# Altium project KX1_DB.PrjPcb (part 1 of 2)
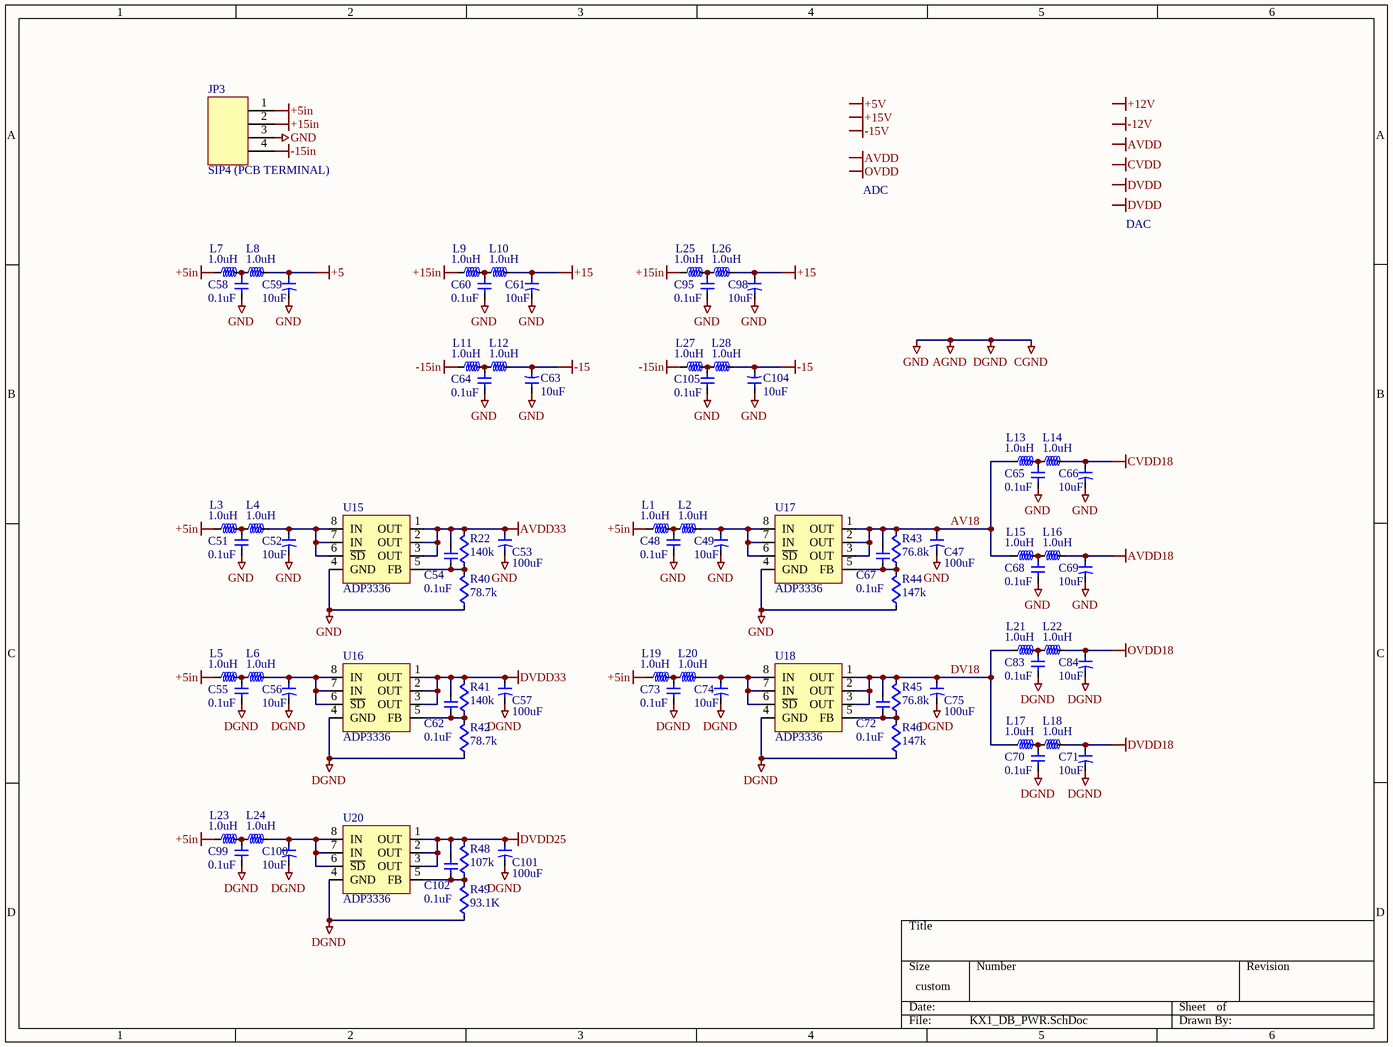
[diagram p0: KX1_DB_PWR.SchDoc]
4 sheets, 201 parts. Net scope: global (net labels, ports and power ports of the same name join across sheets).
Board file: KX1_DB.PcbDoc
Sheets:
  KX1_DB_PWR.SchDoc
  KX1_DB_ADC_2.SchDoc
  KX1_DB_DAC_1.SchDoc
  KX1_DB_EX_CONN.SchDoc

## Sheet KX1_DB_PWR.SchDoc
size 260 x 195 mm

### Parts
C47  100uF  [1206]
C48  0.1uF  [0603w]
C49  10uF  [1206]
C51  0.1uF  [0603w]
C52  10uF  [1206]
C53  100uF  [1206]
C54  0.1uF  [0603w]
C55  0.1uF  [0603w]
C56  10uF  [1206]
C57  100uF  [1206]
C58  0.1uF  [0603w]
C59  10uF  [1206]
C60  0.1uF  [0603w]
C61  10uF  [1206]
C62  0.1uF  [0603w]
C63  10uF  [1206]
C64  0.1uF  [0603w]
C65  0.1uF  [0603w]
C66  10uF  [1206]
C67  0.1uF  [0603w]
C68  0.1uF  [0603w]
C69  10uF  [1206]
C70  0.1uF  [0603w]
C71  10uF  [1206]
C72  0.1uF  [0603w]
C73  0.1uF  [0603w]
C74  10uF  [1206]
C75  100uF  [1206]
C83  0.1uF  [0603w]
C84  10uF  [1206]
C95  0.1uF  [0603w]
C98  10uF  [1206]
C99  0.1uF  [0603w]
C100  10uF  [1206]
C101  100uF  [1206]
C102  0.1uF  [0603w]
C104  10uF  [1206]
C105  0.1uF  [0603w]
JP3  SIP4 (PCB TERMINAL)  [SIP4MOLEX]
L1  1.0uH  [1210]
L2  1.0uH  [1210]
L3  1.0uH  [0805]
L4  1.0uH  [0805]
L5  1.0uH  [0805]
L6  1.0uH  [0805]
L7  1.0uH  [1210]
L8  1.0uH  [1210]
L9  1.0uH  [1210]
L10  1.0uH  [1210]
L11  1.0uH  [1210]
L12  1.0uH  [1210]
L13  1.0uH  [0805]
L14  1.0uH  [0805]
L15  1.0uH  [1210]
L16  1.0uH  [1210]
L17  1.0uH  [0805]
L18  1.0uH  [0805]
L19  1.0uH  [0805]
L20  1.0uH  [0805]
L21  1.0uH  [0805]
L22  1.0uH  [0805]
L23  1.0uH  [0805]
L24  1.0uH  [0805]
L25  1.0uH  [1210]
L26  1.0uH  [1210]
L27  1.0uH  [1210]
L28  1.0uH  [1210]
R22  140k  [0603w]
R40  78.7k  [0603w]
R41  140k  [0603w]
R42  78.7k  [0603w]
R43  76.8k  [0603w]
R44  147k  [0603w]
R45  76.8k  [0603w]
R46  147k  [0603w]
R48  107k  [0603w]
R49  93.1K  [0603w]
U15  ADP3336  [MSOP08]
U16  ADP3336  [MSOP08]
U17  ADP3336  [MSOP08]
U18  ADP3336  [MSOP08]
U20  ADP3336  [MSOP08]

### Nets
+5: C59.1 L8.2
+5in: JP3.1 L1.1 L3.1 L5.1 L7.1 L19.1 L23.1
+15: C61.1 C98.1 L10.2 L26.2
+15in: JP3.2 L9.1 L25.1
-15: C63.2 C104.2 L12.2 L28.2
-15in: JP3.4 L11.1 L27.1
AGND: C47.2 C48.2 C49.2 C51.2 C52.2 C53.2 C55.2 C56.2 C57.2 C58.2 C59.2 C60.2 C61.2 C63.1 C64.2 C65.2 C66.2 C68.2 C69.2 C70.2 C71.2 C73.2 C74.2 C75.2 C83.2 C84.2 C95.2 C98.2 C99.2 C100.2 C101.2 C104.1 C105.2 JP3.3 R40.1 R42.1 R44.1 R46.1 R49.1 U15.4(GND) U16.4(GND) U17.4(GND) U18.4(GND) U20.4(GND)  [also labelled CGND, DGND, GND]
AVDD18: C69.1 L16.2
AVDD33: C53.1 C54.1 R22.2 U15.1(OUT) U15.2(OUT) U15.3(OUT)
CVDD18: C66.1 L14.2
DVDD18: C71.1 L18.2
DVDD25: C101.1 C102.1 R48.2 U20.1(OUT) U20.2(OUT) U20.3(OUT)
DVDD33: C57.1 C62.1 R41.2 U16.1(OUT) U16.2(OUT) U16.3(OUT)
OVDD18: C84.1 L22.2
AV18: C47.1 C67.1 L13.1 L15.1 R43.2 U17.1(OUT) U17.2(OUT) U17.3(OUT)
DV18: C72.1 C75.1 L17.1 L21.1 R45.2 U18.1(OUT) U18.2(OUT) U18.3(OUT)
NetC48_1: C48.1 L1.2 L2.1
NetC49_1: C49.1 L2.2 U17.6(~{SD}) U17.7(IN) U17.8(IN)
NetC51_1: C51.1 L3.2 L4.1
NetC52_1: C52.1 L4.2 U15.6(~{SD}) U15.7(IN) U15.8(IN)
NetC54_2: C54.2 R22.1 R40.2 U15.5(FB)
NetC55_1: C55.1 L5.2 L6.1
NetC56_1: C56.1 L6.2 U16.6(~{SD}) U16.7(IN) U16.8(IN)
NetC58_1: C58.1 L7.2 L8.1
NetC60_1: C60.1 L9.2 L10.1
NetC62_2: C62.2 R41.1 R42.2 U16.5(FB)
NetC64_1: C64.1 L11.2 L12.1
NetC65_1: C65.1 L13.2 L14.1
NetC67_2: C67.2 R43.1 R44.2 U17.5(FB)
NetC68_1: C68.1 L15.2 L16.1
NetC70_1: C70.1 L17.2 L18.1
NetC72_2: C72.2 R45.1 R46.2 U18.5(FB)
NetC73_1: C73.1 L19.2 L20.1
NetC74_1: C74.1 L20.2 U18.6(~{SD}) U18.7(IN) U18.8(IN)
NetC83_1: C83.1 L21.2 L22.1
NetC95_1: C95.1 L25.2 L26.1
NetC99_1: C99.1 L23.2 L24.1
NetC100_1: C100.1 L24.2 U20.6(~{SD}) U20.7(IN) U20.8(IN)
NetC102_2: C102.2 R48.1 R49.2 U20.5(FB)
NetC105_1: C105.1 L27.2 L28.1

### Notes on the sheet
- ADC
- DAC
- Labels drawn without touching a wire or pin: +5V, +12V, +15V, -12V, -15V, AVDD, CVDD, DVDD, OVDD

### Library data of the parts
C47 C53 C57 C75 C101 = CAPACITOR_SM: capacitor; Manufacturer: TDK Corporation; Manufacturer Part Number: C3216X5R0J107M; Capacitance: 100µF; Voltage - Rated: 6.3V; Tolerance: ±20%; Temperature Coefficient: X5R; Supplier 1: Digi-Key; Supplier Part Number 1: 445-6008-1-ND; RoHS: RoHS Compliant; Category: Capacitors; Stock 1: 10697; Pricing 1: 1=1.24, 10=1.034, 100=0.759, 250=0.66, 500=0.616, 1000=0.484 (USD); Mounting Type: Surface Mount, MLCC; Operating Temperature: -55°C ~ 85°C; Applications: General Purpose; Ratings: -; Package / Case: 1206 (3216 Metric); Size / Dimension: 0.126" L x 0.063" W (3.20mm x 1.60mm); Height: -; Thickness: 0.071" (1.80mm); Lead Spacing: -; Features: Low ESR; Packaging: Cut Tape (CT); Lead Style: -; ComponentLink1URL: http://www.tdk.com/pdf/general_A11.pdf; ComponentLink1Description: http://www.tdk.com/pdf/general_A11.pdf
C48 C51 C54 C55 C58 C60 C62 C64 C65 C67 C68 C70 C72 C73 C83 C95 C99 C102 C105 = CAP_SM: capacitor; Manufacturer: Kemet; Manufacturer Part Number: C0603C104K3RACTU; Capacitance: 0.1µF; Temperature Coefficient: X7R; Tolerance: ±10%; Voltage - Rated: 25V; Applications: General Purpose; Category: Capacitors; ComponentLink1Description: http://www.kemet.com/datasheets&C0603C104K3RACTU; ComponentLink1URL: http://www.kemet.com/datasheets&C0603C104K3RACTU; Features: -; Lead Spacing: -; Lead Style: -; Mounting Type: Surface Mount, MLCC; Operating Temperature: -55°C ~ 125°C; Package / Case: 0603 (1608 Metric); Packaging: Cut Tape (CT); Pricing 1: 10=0.075, 100=0.027, 250=0.01952, 500=0.0144, 1000=0.00975 (USD); Ratings: -; RoHS: RoHS Compliant; Size / Dimension: 0.063" L x 0.032" W (1.60mm x 0.80mm); Stock 1: 2338960; Supplier 1: Digi-Key; Supplier Part Number 1: 399-1281-1-ND; Thickness: 0.80mm
C49 C52 C56 C59 C61 C63 C66 C69 C71 C74 C84 C100 C104 = CAPACITOR_SM: ELECTROLYTIC capacitor; Manufacturer: Nichicon; Manufacturer Part Number: F971C106MAA; Manufacturer Size Code: A; Capacitance: 10µF; Temperature Coefficient: X5R; Tolerance: ±20%; Voltage - Rated: 16V; ESR (Equivalent Series Resistance): 3.500 Ohm; Type: Molded; Applications: General Purpose; Category: Capacitors; ComponentLink1Description: http://nichicon-us.com/english/products/pdf/e-f97.pdf; ComponentLink1URL: http://nichicon-us.com/english/products/pdf/e-f97.pdf; Features: High Reliability; Height: 0.071" (1.80mm); Lead Spacing: -; Lead Style: -; Mounting Type: Surface Mount; Operating Temperature: -55°C ~ 125°C; Package / Case: 1206 (3216 Metric); Packaging: Cut Tape (CT); Pricing 1: 1=0.5, 10=0.398, 100=0.24, 250=0.18, 500=0.1536, 1000=0.12 (USD); Ratings: -; RoHS: RoHS Compliant; Size / Dimension: 0.126" L x 0.063" W (3.20mm x 1.60mm); Stock 1: 885; Supplier 1: Digi-Key; Supplier Part Number 1: 493-4304-1-ND; Thickness: 0.071" (1.80mm); Lifetime @ Temp.: -
C98 = CAPACITOR_SM: ELECTROLYTIC capacitor; Manufacturer: Nichicon; Manufacturer Part Number: F971C106MAA; Manufacturer Size Code: A; Capacitance: 10µF; Voltage - Rated: 16V; Tolerance: ±20%; Temperature Coefficient: X5R; ESR (Equivalent Series Resistance): 3.500 Ohm; Type: Molded; Supplier 1: Digi-Key; Supplier Part Number 1: 493-4304-1-ND; RoHS: RoHS Compliant; Category: Capacitors; Stock 1: 885; Pricing 1: 1=0.5, 10=0.398, 100=0.24, 250=0.18, 500=0.1536, 1000=0.12 (USD); Mounting Type: Surface Mount; Operating Temperature: -55°C ~ 125°C; Applications: General Purpose; Ratings: -; Package / Case: 1206 (3216 Metric); Size / Dimension: 0.126" L x 0.063" W (3.20mm x 1.60mm); Height: 0.071" (1.80mm); Thickness: 0.071" (1.80mm); Lead Spacing: -; Features: High Reliability; Packaging: Cut Tape (CT); Lead Style: -; ComponentLink1URL: http://nichicon-us.com/english/products/pdf/e-f97.pdf; ComponentLink1Description: http://nichicon-us.com/english/products/pdf/e-f97.pdf; Lifetime @ Temp.: -
JP3 = SIP4 (PCB TERMINAL): 4 pin molex connector; Manufacturer: Molex Inc; Connector Type: Header, Unshrouded; Number of Positions: 4; Number of Positions Loaded: All; Pitch: 0.100" (2.54mm); Supplier 1: Digi-Key; Supplier Part Number 1: WM2746-ND; Manufacturer Part Number: 22-29-2041; RoHS: RoHS Compliant; Category: Connectors, Interconnects; Stock 1: 6126; Pricing 1: 1=0.95, 10=0.664, 50=0.5124, 100=0.446, 250=0.3796, 500=0.36062, 1000=0.32266, 2500=0.25623, 5000=0.25243 (USD); Contact Type: Male Pin; Number of Rows: 1; Row Spacing: -; Contact Mating Length: 0.295" (7.49mm); Mounting Type: Through Hole; Termination: Solder; Fastening Type: Friction Lock; Features: -; Contact Finish: Gold; Contact Finish Thickness: 20µin (0.51µm); Color: White; Packaging: Bulk; ComponentLink1URL: http://www.molex.com/pdm_docs/sd/022292041_sd.pdf; ComponentLink1Description: http://www.molex.com/pdm_docs/sd/022292041_sd.pdf
L1 L7 L9 L11 L15 L25 L27 = INDUCTOR_SM: inductor; Manufacturer: Murata Electronics North America; Manufacturer Part Number: LQH32CN1R0M23L; Current: 800mA; DC Resistance (DCR): 117 mOhm Max; Frequency - Test: 1MHz; Inductance: 1µH; Self Resonant Freq: 96MHz; Shielding: Unshielded; Tolerance: ±20%; Type: Ferrite Core; Material - Core: Ferrite; Applications: Power Supplies; Category: Inductors, Coils, Chokes; ComponentLink1Description: http://search.murata.co.jp/Ceramy/image/img/PDF/ENG/L0075S0093LQH32C_23~33.pdf; ComponentLink1URL: http://search.murata.co.jp/Ceramy/image/img/PDF/ENG/L0075S0093LQH32C_23~33.pdf; Current - Saturation: -; Current - Temperature Rise: -; Mounting Type: Surface Mount; Operating Temperature: -40°C ~ 85°C; Package / Case: 1210 (3225 Metric); Packaging: Cut Tape (CT); Q @ Freq: -; RoHS: RoHS Compliant; Supplier 1: Digi-Key; Supplier Part Number 1: 490-2493-1-ND; Stock 1: 5265; Pricing 1: 1=0.27, 10=0.258, 50=0.2422, 100=0.2261, 500=0.17766, 1000=0.14535 (USD)
L2 L8 L10 L12 L16 L26 L28 = INDUCTOR_SM: inductor; Manufacturer: Murata Electronics North America; Manufacturer Part Number: LQH32CN1R0M23L; Inductance: 1µH; Current: 800mA; Type: Ferrite Core; Tolerance: ±20%; Shielding: Unshielded; DC Resistance (DCR): 117 mOhm Max; Self Resonant Freq: 96MHz; Frequency - Test: 1MHz; Material - Core: Ferrite; RoHS: RoHS Compliant; Category: Inductors, Coils, Chokes; Current - Saturation: -; Current - Temperature Rise: -; Q @ Freq: -; Package / Case: 1210 (3225 Metric); Mounting Type: Surface Mount; Packaging: Cut Tape (CT); Operating Temperature: -40°C ~ 85°C; Applications: Power Supplies; ComponentLink1URL: http://search.murata.co.jp/Ceramy/image/img/PDF/ENG/L0075S0093LQH32C_23~33.pdf; ComponentLink1Description: http://search.murata.co.jp/Ceramy/image/img/PDF/ENG/L0075S0093LQH32C_23~33.pdf; Supplier 1: Digi-Key; Supplier Part Number 1: 490-2493-1-ND; Stock 1: 5265; Pricing 1: 1=0.27, 10=0.258, 50=0.2422, 100=0.2261, 500=0.17766, 1000=0.14535 (USD)
L3 L5 L13 L17 L19 L21 L23 = INDUCTOR_SM: inductor; Manufacturer: Murata Electronics North America; Manufacturer Part Number: LQM21FN1R0N00D; Current: 220mA; DC Resistance (DCR): 260 mOhm Max; Frequency - Test: 1MHz; Inductance: 1µH; Self Resonant Freq: 105MHz; Shielding: Shielded; Tolerance: ±30%; Current - Saturation: -; Current - Temperature Rise: -; Mounting Type: Surface Mount; Operating Temperature: -40°C ~ 85°C; Package / Case: 0805 (2012 Metric); Packaging: Cut Tape (CT); Q @ Freq: -; RoHS: RoHS Compliant; Type: -; Supplier 1: Digi-Key; Supplier Part Number 1: 490-4026-1-ND; Stock 1: 0; Pricing 1: 1=0.11, 10=0.104, 50=0.0972, 100=0.0907, 500=0.07122, 1000=0.05828 (USD); Material - Core: -
L4 L6 L14 L18 L20 L22 L24 = INDUCTOR_SM: inductor; Manufacturer: Murata Electronics North America; Manufacturer Part Number: LQM21FN1R0N00D; Inductance: 1µH; Current: 220mA; Tolerance: ±30%; Shielding: Shielded; DC Resistance (DCR): 260 mOhm Max; Self Resonant Freq: 105MHz; Frequency - Test: 1MHz; RoHS: RoHS Compliant; Current - Saturation: -; Current - Temperature Rise: -; Type: -; Q @ Freq: -; Package / Case: 0805 (2012 Metric); Mounting Type: Surface Mount; Packaging: Cut Tape (CT); Operating Temperature: -40°C ~ 85°C; Supplier 1: Digi-Key; Supplier Part Number 1: 490-4026-1-ND; Stock 1: 0; Pricing 1: 1=0.11, 10=0.104, 50=0.0972, 100=0.0907, 500=0.07122, 1000=0.05828 (USD); Material - Core: -
R22 R41 = RES_SM: resistor; Manufacturer: Yageo; Manufacturer Part Number: RC0603FR-07140KL; Power (Watts): 0.1W, 1/10W; Temperature Coefficient: ±100ppm/°C; Tolerance: ±1%; Supplier 1: Digi-Key; Supplier Part Number 1: 311-140KHRCT-ND; RoHS: RoHS Compliant; Category: Resistors; Stock 1: 612355; Pricing 1: 10=0.014, 50=0.0104, 100=0.0079, 250=0.00584, 500=0.00432, 1000=0.00288 (USD); Resistance (Ohms): 140K; Composition: Thick Film; Features: -; Size / Dimension: 0.063" L x 0.031" W (1.60mm x 0.80mm); Height: 0.018" (0.45mm); Number of Terminations: 2; Packaging: Cut Tape (CT); Package / Case: 0603 (1608 Metric); ComponentLink1URL: http://www.yageo.com/documents/recent/PYu-RC0603_51_RoHS_L_4.pdf; ComponentLink1Description: http://www.yageo.com/documents/recent/PYu-RC0603_51_RoHS_L_4.pdf
R40 R42 = RES_SM: resistor; Manufacturer: Yageo; Manufacturer Part Number: RC0603FR-0778K7L; Power (Watts): 0.1W, 1/10W; Temperature Coefficient: ±100ppm/°C; Tolerance: ±1%; Supplier 1: Digi-Key; Supplier Part Number 1: 311-78.7KHRCT-ND; RoHS: RoHS Compliant; Category: Resistors; Stock 1: 134270; Pricing 1: 10=0.014, 50=0.0104, 100=0.0079, 250=0.00584, 500=0.00432, 1000=0.00288 (USD); Resistance (Ohms): 78.7K; Composition: Thick Film; Features: -; Size / Dimension: 0.063" L x 0.031" W (1.60mm x 0.80mm); Height: 0.018" (0.45mm); Number of Terminations: 2; Packaging: Cut Tape (CT); Package / Case: 0603 (1608 Metric); ComponentLink1URL: http://www.yageo.com/documents/recent/PYu-RC0603_51_RoHS_L_4.pdf; ComponentLink1Description: http://www.yageo.com/documents/recent/PYu-RC0603_51_RoHS_L_4.pdf
R43 R45 = RES_SM: resistor; Manufacturer: Yageo; Manufacturer Part Number: RC0603FR-0776K8L; Power (Watts): 0.1W, 1/10W; Temperature Coefficient: ±100ppm/°C; Tolerance: ±1%; Supplier 1: Digi-Key; Supplier Part Number 1: 311-76.8KHRCT-ND; RoHS: RoHS Compliant; Category: Resistors; Stock 1: 91480; Pricing 1: 10=0.014, 50=0.0104, 100=0.0079, 250=0.00584, 500=0.00432, 1000=0.00288 (USD); Resistance (Ohms): 76.8K; Composition: Thick Film; Features: -; Size / Dimension: 0.063" L x 0.031" W (1.60mm x 0.80mm); Height: 0.018" (0.45mm); Number of Terminations: 2; Packaging: Cut Tape (CT); Package / Case: 0603 (1608 Metric); ComponentLink1URL: http://www.yageo.com/documents/recent/PYu-RC0603_51_RoHS_L_4.pdf; ComponentLink1Description: http://www.yageo.com/documents/recent/PYu-RC0603_51_RoHS_L_4.pdf
R44 R46 = RES_SM: resistor; Manufacturer: Yageo; Manufacturer Part Number: RC0603FR-07147KL; Power (Watts): 0.1W, 1/10W; Temperature Coefficient: ±100ppm/°C; Tolerance: ±1%; Supplier 1: Digi-Key; Supplier Part Number 1: 311-147KHRCT-ND; RoHS: RoHS Compliant; Category: Resistors; Stock 1: 53540; Pricing 1: 10=0.014, 50=0.0104, 100=0.0079, 250=0.00584, 500=0.00432, 1000=0.00288 (USD); Resistance (Ohms): 147K; Composition: Thick Film; Features: -; Size / Dimension: 0.063" L x 0.031" W (1.60mm x 0.80mm); Height: 0.018" (0.45mm); Number of Terminations: 2; Packaging: Cut Tape (CT); Package / Case: 0603 (1608 Metric); ComponentLink1URL: http://www.yageo.com/documents/recent/PYu-RC0603_51_RoHS_L_4.pdf; ComponentLink1Description: http://www.yageo.com/documents/recent/PYu-RC0603_51_RoHS_L_4.pdf
R48 = RES_SM: resistor; Manufacturer: Yageo; Manufacturer Part Number: RC0603FR-07107KL; Power (Watts): 0.1W, 1/10W; Temperature Coefficient: ±100ppm/°C; Tolerance: ±1%; Supplier 1: Digi-Key; Supplier Part Number 1: 311-107KHRCT-ND; RoHS: RoHS Compliant; Category: Resistors; Stock 1: 136570; Pricing 1: 10=0.014, 50=0.0104, 100=0.0079, 250=0.00584, 500=0.00432, 1000=0.00288 (USD); Resistance (Ohms): 107K; Composition: Thick Film; Features: -; Size / Dimension: 0.063" L x 0.031" W (1.60mm x 0.80mm); Height: 0.018" (0.45mm); Number of Terminations: 2; Packaging: Cut Tape (CT); Package / Case: 0603 (1608 Metric); ComponentLink1URL: http://www.yageo.com/documents/recent/PYu-RC0603_51_RoHS_L_4.pdf; ComponentLink1Description: http://www.yageo.com/documents/recent/PYu-RC0603_51_RoHS_L_4.pdf
R49 = RES_SM: resistor; Manufacturer: Yageo; Manufacturer Part Number: RC0603FR-0793K1L; Power (Watts): 0.1W, 1/10W; Temperature Coefficient: ±100ppm/°C; Tolerance: ±1%; Supplier 1: Digi-Key; Supplier Part Number 1: 311-93.1KHRCT-ND; RoHS: RoHS Compliant; Category: Resistors; Stock 1: 109138; Pricing 1: 10=0.014, 50=0.0104, 100=0.0079, 250=0.00584, 500=0.00432, 1000=0.00288 (USD); Resistance (Ohms): 93.1K; Composition: Thick Film; Features: -; Size / Dimension: 0.063" L x 0.031" W (1.60mm x 0.80mm); Height: 0.018" (0.45mm); Number of Terminations: 2; Packaging: Cut Tape (CT); Package / Case: 0603 (1608 Metric); ComponentLink1URL: http://www.yageo.com/documents/recent/PYu-RC0603_51_RoHS_L_4.pdf; ComponentLink1Description: http://www.yageo.com/documents/recent/PYu-RC0603_51_RoHS_L_4.pdf
U15-U18 U20 = ADP3336: regulator; Manufacturer: Analog Devices Inc; Manufacturer Part Number: ADP3336ARMZ-REEL7; Regulator Topology: Positive Adjustable; Voltage - Output: 1.5 V ~ 10 V; Voltage - Input: 2.6 V ~ 12 V; Voltage - Dropout (Typical): 0.2V @ 500mA; Number of Regulators: 1; Current - Output: 500mA; Supplier 1: Digi-Key; Supplier Part Number 1: ADP3336ARMZ-REEL7CT-ND; RoHS: RoHS Compliant; Category: Integrated Circuits (ICs); Stock 1: 10613; Pricing 1: 1=3.22, 25=2.484, 100=2.254, 250=2.024, 500=1.748 (USD); Current - Limit (Min): -; Operating Temperature: -40°C ~ 85°C; Mounting Type: Surface Mount; Package / Case: 8-TSSOP, 8-MSOP (0.118", 3.00mm Width); Supplier Device Package: 8-MSOP; Packaging: Cut Tape (CT); ComponentLink1URL: http://www.analog.com/static/imported-files/data_sheets/ADP3336.pdf; ComponentLink1Description: http://www.analog.com/static/imported-files/data_sheets/ADP3336.pdf

## Sheet KX1_DB_ADC_2.SchDoc
size A
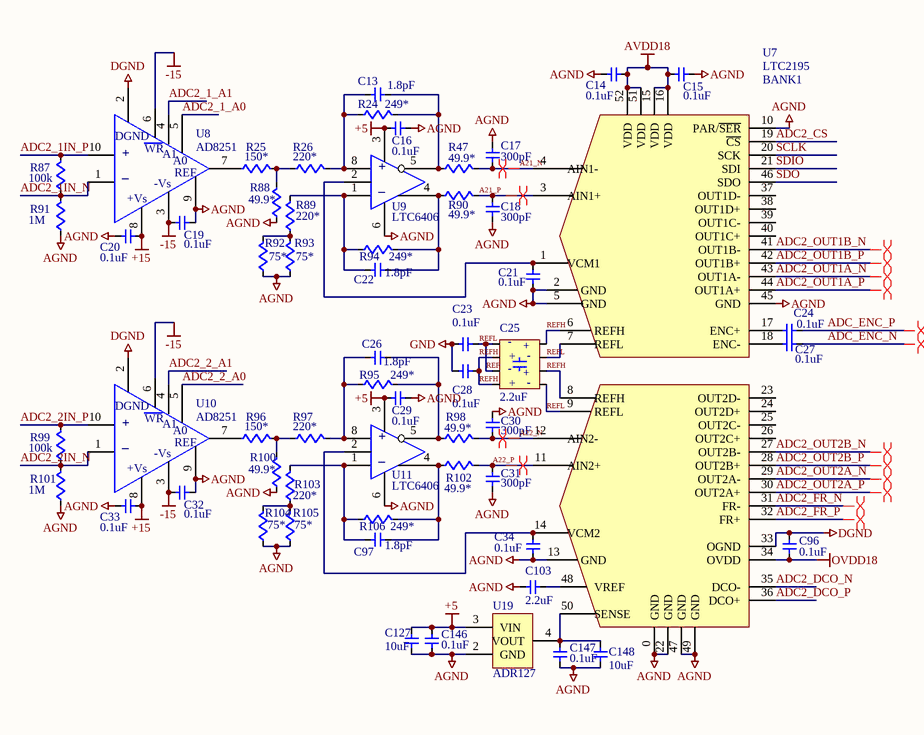
[diagram p1: KX1_DB_ADC_2.SchDoc]

### Parts
C13  1.8pF  [0603w]
C14  0.1uF  [0603w]
C15  0.1uF  [0603w]
C16  0.1uF  [0603w]
C17  300pF  [0603w]
C18  300pF  [0603w]
C19  0.1uF  [0603w]
C20  0.1uF  [0603w]
C21  0.1uF  [0603w]
C22  1.8pF  [0603w]
C23  0.1uF  [0603w]
C24  0.1uF  [1206]
C25  2.2uF  [1206CLL]
C26  1.8pF  [0603w]
C27  0.1uF  [1206]
C28  0.1uF  [0603w]
C29  0.1uF  [0603w]
C30  300pF  [0603w]
C31  300pF  [0603w]
C32  0.1uF  [0603w]
C33  0.1uF  [0603w]
C34  0.1uF  [0603w]
C96  0.1uF  [0603w]
C97  1.8pF  [0603w]
C103  2.2uF  [0603w]
C127  10uF  [0603w]
C146  0.1uF  [0603w]
C147  0.1uF  [0603w]
C148  10uF  [0603w]
R24  249*  [0603w]
R25  150*  [0603w]
R26  220*  [0603w]
R47  49.9*  [0603w]
R87  100k  [0603w]
R88  49.9*  [0603w]
R89  220*  [0603w]
R90  49.9*  [0603w]
R91  1M  [0603w]
R92  75*  [0603w]
R93  75*  [0603w]
R94  249*  [0603w]
R95  249*  [0603w]
R96  150*  [0603w]
R97  220*  [0603w]
R98  49.9*  [0603w]
R99  100k  [0603w]
R100  49.9*  [0603w]
R101  1M  [0603w]
R102  49.9*  [0603w]
R103  220*  [0603w]
R104  75*  [0603w]
R105  75*  [0603w]
R106  249*  [0603w]
U7  LTC2195  [UKG - QFN52]
U8  AD8251  [MSOP10sm]
U9  LTC6406  [MSOP08]
U10  AD8251  [MSOP10sm]
U11  LTC6406  [MSOP08]
U19  ADR127  [TSOT-6]

### Nets
+5: C16.1 C29.1 C127.1 C146.2 U9.3 U11.3 U19.3(VIN)
+15: C20.1 C33.1 U8.8 U10.8
-15: C19.1 C32.1 U8.3 U8.6 U10.3 U10.6
AGND: C14.2 C15.2 C16.2 C17.1 C18.2 C19.2 C20.2 C21.2 C23.2 C28.2 C29.2 C30.1 C31.2 C32.2 C33.2 C34.2 C96.1 C103.2 C127.2 C146.1 C147.1 C148.2 R88.1 R91.1 R92.1 R93.1 R100.1 R101.1 R104.1 R105.1 U7.0(GND) U7.2(GND) U7.5(GND) U7.10(PAR/~{SER}) U7.13(GND) U7.22(GND) U7.33(OGND) U7.45(GND) U7.47(GND) U7.49(GND) U8.2 U8.9 U9.6 U10.2 U10.9 U11.6 U19.2(GND)  [also labelled DGND, GND]
AVDD18: C14.1 C15.1 U7.15(VDD) U7.16(VDD) U7.51(VDD) U7.52(VDD)
OVDD18: C96.2 U7.34(OVDD)
A21_N: C17.2 R47.2 U7.4(AIN1-)
A21_P: C18.1 R90.2 U7.3(AIN1+)
A22_N: C30.2 R98.2 U7.12(AIN2-)
A22_P: C31.1 R102.2 U7.11(AIN2+)
ADC2_1_A0: U8.5
ADC2_1_A1: U8.4
ADC2_1IN_N: R87.1 R91.2 U8.1
ADC2_1IN_P: R87.2 U8.10
ADC2_2_A0: U10.5
ADC2_2_A1: U10.4
ADC2_2IN_N: R99.1 R101.2 U10.1
ADC2_2IN_P: R99.2 U10.10
ADC2_CS: U7.19(~{CS})
ADC2_DCO_N: U7.35(DCO-)
ADC2_DCO_P: U7.36(DCO+)
ADC2_FR_N: U7.31(FR-)
ADC2_FR_P: U7.32(FR+)
ADC2_OUT1A_N: U7.43(OUT1A-)
ADC2_OUT1A_P: U7.44(OUT1A+)
ADC2_OUT1B_N: U7.41(OUT1B-)
ADC2_OUT1B_P: U7.42(OUT1B+)
ADC2_OUT2A_N: U7.29(OUT2A-)
ADC2_OUT2A_P: U7.30(OUT2A+)
ADC2_OUT2B_N: U7.27(OUT2B-)
ADC2_OUT2B_P: U7.28(OUT2B+)
ADC_ENC_N: C27.2
ADC_ENC_P: C24.2
REFH: C25.2 C25.4 C25.6 C25.8 C28.1 U7.6(REFH) U7.8(REFH)
REFL: C23.1 C25.1 C25.3 C25.5 C25.7 U7.7(REFL) U7.9(REFL)
SCLK: U7.20(SCK)
SDIO: U7.21(SDI)
SDO: U7.46(SDO)
NetC13_1: C13.1 R24.1 R26.2 U9.8
NetC13_2: C13.2 R24.2 R47.1 U9.5
NetC21_1: C21.1 U7.1(VCM1) U9.2
NetC22_1: C22.1 R89.2 R94.1 U9.1
NetC22_2: C22.2 R90.1 R94.2 U9.4
NetC24_1: C24.1 U7.17(ENC+)
NetC26_1: C26.1 R95.1 R97.2 U11.8
NetC26_2: C26.2 R95.2 R98.1 U11.5
NetC27_1: C27.1 U7.18(ENC-)
NetC34_1: C34.1 U7.14(VCM2) U11.2
NetC97_1: C97.1 R103.2 R106.1 U11.1
NetC97_2: C97.2 R102.1 R106.2 U11.4
NetC103_1: C103.1 U7.48(VREF)
NetC147_2: C147.2 C148.1 U7.50(SENSE) U19.4(VOUT)
NetR25_1: R25.1 U8.7
NetR25_2: R25.2 R26.1 R88.2
NetR89_1: R89.1 R92.2 R93.2
NetR96_1: R96.1 U10.7
NetR96_2: R96.2 R97.1 R100.2
NetR103_1: R103.1 R104.2 R105.2

Not connected (* = marked no-connect by the designer): U7 23(OUT2D-) 24(OUT2D+) 25(OUT2C-) 26(OUT2C+) 37(OUT1D-) 38(OUT1D+) 39(OUT1C-) 40(OUT1C+); U19 1(NC) 5(NC) 6(NC)

### Layout directives
differential pair: A21_N, A21_P, A22_N, A22_P, ADC2_FR_N, ADC2_FR_P, ADC2_OUT1A_N, ADC2_OUT1A_P, ADC2_OUT1B_N, ADC2_OUT1B_P, ADC2_OUT2A_N, ADC2_OUT2A_P, ADC2_OUT2B_N, ADC2_OUT2B_P, ADC_ENC_N, ADC_ENC_P

### Notes on the sheet
- (near U7) BANK1
- (in symbol AD8139) +; _
- (in symbol AD8251) DGND; WR; +; A1; A0; _; REF; -Vs; +Vs
- (in symbol CAP_SM Interdigitated) +

### Library data of the parts
C13 C17 C18 C22 C26 C30 C31 C97 = CAP_SM_1: capacitor; Supplier 1: Digi-Key
  C13 C22 C26 C97: Supplier Part Number 1: 712-1328-1-ND
  C17 C18 C30 C31: Supplier Part Number 1: 490-1438-1-ND
C14 C15 C19-C21 C23 C28 C29 C32-C34 C96 C146 C147 = CAP_SM_1: capacitor; Manufacturer: Kemet; Manufacturer Part Number: C0603C104K3RACTU; Capacitance: 0.1µF; Temperature Coefficient: X7R; Tolerance: ±10%; Voltage - Rated: 25V; Applications: General Purpose; Category: Capacitors; ComponentLink1Description: http://www.kemet.com/datasheets&C0603C104K3RACTU; ComponentLink1URL: http://www.kemet.com/datasheets&C0603C104K3RACTU; Features: -; Lead Spacing: -; Lead Style: -; Mounting Type: Surface Mount, MLCC; Operating Temperature: -55°C ~ 125°C; Package / Case: 0603 (1608 Metric); Packaging: Cut Tape (CT); Pricing 1: 10=0.075, 100=0.027, 250=0.01952, 500=0.0144, 1000=0.00975 (USD); Ratings: -; RoHS: RoHS Compliant; Size / Dimension: 0.063" L x 0.031" W (1.60mm x 0.80mm); Stock 1: 1185883; Supplier 1: Digi-Key; Supplier Part Number 1: 399-1281-1-ND; Thickness: 0.034" (0.87mm)
C16 = CAP_SM_1: capacitor; Manufacturer: Kemet; Manufacturer Part Number: C0603C104K3RACTU; Capacitance: 0.1µF; Voltage - Rated: 25V; Tolerance: ±10%; Temperature Coefficient: X7R; Supplier 1: Digi-Key; Supplier Part Number 1: 399-1281-1-ND; RoHS: RoHS Compliant; Category: Capacitors; Stock 1: 1185883; Pricing 1: 10=0.075, 100=0.027, 250=0.01952, 500=0.0144, 1000=0.00975 (USD); Mounting Type: Surface Mount, MLCC; Operating Temperature: -55°C ~ 125°C; Applications: General Purpose; Ratings: -; Package / Case: 0603 (1608 Metric); Size / Dimension: 0.063" L x 0.031" W (1.60mm x 0.80mm); Height: -; Thickness: 0.034" (0.87mm); Lead Spacing: -; Features: -; Packaging: Cut Tape (CT); Lead Style: -; ComponentLink1URL: http://www.kemet.com/datasheets&C0603C104K3RACTU; ComponentLink1Description: http://www.kemet.com/datasheets&C0603C104K3RACTU
C24 C27 = CAP_SM_1: capacitor; Manufacturer: Murata Electronics North America; Manufacturer Part Number: GRM31C5C1E104JA01L; Capacitance: 0.1µF; Voltage - Rated: 25V; Tolerance: ±5%; Temperature Coefficient: C0G, NP0; Supplier 1: Digi-Key; Supplier Part Number 1: 490-1767-1-ND; RoHS: RoHS Compliant; Category: Capacitors; Stock 1: 374793; Pricing 1: 1=0.57, 10=0.48, 50=0.3436, 100=0.3007, 250=0.23628, 500=0.2148, 1000=0.17184 (USD); Mounting Type: Surface Mount, MLCC; Operating Temperature: -55°C ~ 125°C; Applications: General Purpose; Ratings: -; Package / Case: 1206 (3216 Metric); Size / Dimension: 0.126" L x 0.063" W (3.20mm x 1.60mm); Height: -; Thickness: 0.071" (1.80mm); Lead Spacing: -; Features: -; Packaging: Cut Tape (CT); Lead Style: -; ComponentLink1URL: http://search.murata.co.jp/Ceramy/image/img/PDF/ENG/GRM31C5C1E104JA01.pdf; ComponentLink1Description: http://search.murata.co.jp/Ceramy/image/img/PDF/ENG/GRM31C5C1E104JA01.pdf
C25 = CAP_SM Interdigitated: INTERDIGITATED capacitor; Manufacturer: TDK Corporation; Manufacturer Part Number: CLLE1AX7S0G225M/0.95; Capacitance: 2.2µF; Voltage - Rated: 4V; Tolerance: ±20%; Temperature Coefficient: X7S; Supplier 1: Digi-Key; Supplier Part Number 1: 445-3406-1-ND; RoHS: RoHS Compliant; Category: Capacitors; Stock 1: 11249; Pricing 1: 1=0.68, 10=0.54, 100=0.325, 250=0.24376, 500=0.208, 1000=0.1625 (USD); Mounting Type: Surface Mount, MLCC; Operating Temperature: -55°C ~ 125°C; Applications: General Purpose; Ratings: -; Package / Case: 0805 (2012 Metric); Size / Dimension: 0.079" L x 0.049" W (2.00mm x 1.25mm); Height: -; Thickness: 0.037" (0.95mm); Lead Spacing: -; Features: Low ESL (Multi-Terminal); Packaging: Cut Tape (CT); Lead Style: -; ComponentLink1URL: http://www.tdk.com/pdf/uli_A11.pdf; ComponentLink1Description: http://www.tdk.com/pdf/uli_A11.pdf
C103 = CAP_SM_1: capacitor; Manufacturer: AVX Corporation; Manufacturer Part Number: 06036C225KAT2A; Capacitance: 2.2µF; Voltage - Rated: 6.3V; Tolerance: ±10%; Temperature Coefficient: X7R; Supplier 1: Digi-Key; Supplier Part Number 1: 478-5316-1-ND; RoHS: RoHS Compliant; Category: Capacitors; Stock 1: 284343; Pricing 1: 10=0.209, 100=0.1235, 500=0.07126, 1000=0.0494 (USD); Mounting Type: Surface Mount, MLCC; Operating Temperature: -55°C ~ 125°C; Applications: General Purpose; Ratings: -; Package / Case: 0603 (1608 Metric); Size / Dimension: 0.063" L x 0.032" W (1.60mm x 0.81mm); Height: -; Thickness: 0.035" (0.90mm); Lead Spacing: -; Features: -; Packaging: Cut Tape (CT); Lead Style: -; ComponentLink1URL: http://www.avx.com/docs/Catalogs/cx7r.pdf; ComponentLink1Description: http://www.avx.com/docs/Catalogs/cx7r.pdf
C127 C148 = CAP_SM_1: capacitor; Manufacturer: Murata Electronics North America; Manufacturer Part Number: GRM188R60J106ME47D; Capacitance: 10µF; Voltage - Rated: 6.3V; Tolerance: ±20%; Temperature Coefficient: X5R; Supplier 1: Digi-Key; Supplier Part Number 1: 490-3896-1-ND; RoHS: RoHS Compliant; Category: Capacitors; Stock 1: 1274844; Pricing 1: 1=0.47, 10=0.369, 50=0.2428, 100=0.1926, 250=0.14236, 500=0.11056, 1000=0.0871 (USD); Mounting Type: Surface Mount, MLCC; Operating Temperature: -55°C ~ 85°C; Applications: General Purpose; Ratings: -; Package / Case: 0603 (1608 Metric); Size / Dimension: 0.063" L x 0.031" W (1.60mm x 0.80mm); Height: -; Thickness: 0.035" (0.90mm); Lead Spacing: -; Features: -; Packaging: Cut Tape (CT); Lead Style: -; ComponentLink1URL: http://search.murata.co.jp/Ceramy/image/img/PDF/ENG/GRM188R60J106ME47.pdf; ComponentLink1Description: http://search.murata.co.jp/Ceramy/image/img/PDF/ENG/GRM188R60J106ME47.pdf
R24-R26 R89 R94-R97 R103 R106 = RES_SM: resistor; Supplier 1: Digi-Key
  R24 R94 R95 R106: Supplier Part Number 1: RNCS0603BKE249RCT-ND
  R25 R96: Supplier Part Number 1: RNCS0603BKE150RCT-ND
  R26 R89 R97 R103: Supplier Part Number 1: RG16P220BCT-ND
R47 R88 R90 R98 R100 R102 = RES_SM: resistor; Manufacturer: Stackpole Electronics Inc; Manufacturer Part Number: RNCS0603BKE49R9; Resistance (Ohms): 49.9; Power (Watts): 0.063W, 1/16W; Temperature Coefficient: ±25ppm/°C; Tolerance: ±0.1%; Supplier 1: Digi-Key; Supplier Part Number 1: RNCS0603BKE49R9CT-ND; RoHS: RoHS Compliant; Category: Resistors; Stock 1: 13782; Pricing 1: 1=0.7, 10=0.475, 50=0.2876, 100=0.2375, 250=0.18752, 500=0.16 (USD); Composition: Thin Film; Features: Anti-Corrosive, Moisture Resistant; Size / Dimension: 0.061" L x 0.031" W (1.55mm x 0.80mm); Height: 0.018" (0.45mm); Number of Terminations: 2; Packaging: Cut Tape (CT); Package / Case: 0603 (1608 Metric); ComponentLink1URL: http://www.seielect.com/Catalog/SEI-rncs.pdf; ComponentLink1Description: http://www.seielect.com/Catalog/SEI-rncs.pdf
R87 R99 = RES_SM: resistor; Manufacturer: Yageo; Manufacturer Part Number: RC0603FR-07100KL; Power (Watts): 0.1W, 1/10W; Temperature Coefficient: ±100ppm/°C; Tolerance: ±1%; Supplier 1: Digi-Key; Supplier Part Number 1: 311-100KHRCT-ND; RoHS: RoHS Compliant; Category: Resistors; Stock 1: 3397757; Pricing 1: 10=0.014, 50=0.0104, 100=0.0079, 250=0.00584, 500=0.00432, 1000=0.00288 (USD); Resistance (Ohms): 100K; Composition: Thick Film; Features: -; Size / Dimension: 0.063" L x 0.031" W (1.60mm x 0.80mm); Height: 0.018" (0.45mm); Number of Terminations: 2; Packaging: Cut Tape (CT); Package / Case: 0603 (1608 Metric); ComponentLink1URL: http://www.yageo.com/documents/recent/PYu-RC0603_51_RoHS_L_4.pdf; ComponentLink1Description: http://www.yageo.com/documents/recent/PYu-RC0603_51_RoHS_L_4.pdf
R91 R101 = RES_SM: resistor; Manufacturer: Yageo; Manufacturer Part Number: RC0603FR-071ML; Power (Watts): 0.1W, 1/10W; Temperature Coefficient: ±100ppm/°C; Tolerance: ±1%; Supplier 1: Digi-Key; Supplier Part Number 1: 311-1.00MHRCT-ND; RoHS: RoHS Compliant; Category: Resistors; Stock 1: 1849601; Pricing 1: 10=0.014, 50=0.0104, 100=0.0079, 250=0.00584, 500=0.00432, 1000=0.00288 (USD); Resistance (Ohms): 1M; Composition: Thick Film; Features: -; Size / Dimension: 0.063" L x 0.031" W (1.60mm x 0.80mm); Height: 0.018" (0.45mm); Number of Terminations: 2; Packaging: Cut Tape (CT); Package / Case: 0603 (1608 Metric); ComponentLink1URL: http://www.yageo.com/documents/recent/PYu-RC0603_51_RoHS_L_4.pdf; ComponentLink1Description: http://www.yageo.com/documents/recent/PYu-RC0603_51_RoHS_L_4.pdf
R92 R93 R104 R105 = RES_SM: resistor; Manufacturer: Stackpole Electronics Inc; Manufacturer Part Number: RNCS0603BKE75R0; Resistance (Ohms): 75; Power (Watts): 0.063W, 1/16W; Temperature Coefficient: ±25ppm/°C; Tolerance: ±0.1%; Supplier 1: Digi-Key; Supplier Part Number 1: RNCS0603BKE75R0CT-ND; RoHS: RoHS Compliant; Category: Resistors; Stock 1: 2583; Pricing 1: 1=0.7, 10=0.475, 50=0.2876, 100=0.2375, 250=0.18752, 500=0.16 (USD); Composition: Thin Film; Features: Anti-Corrosive, Moisture Resistant; Size / Dimension: 0.061" L x 0.031" W (1.55mm x 0.80mm); Height: 0.018" (0.45mm); Number of Terminations: 2; Packaging: Cut Tape (CT); Package / Case: 0603 (1608 Metric); ComponentLink1URL: http://www.seielect.com/Catalog/SEI-rncs.pdf; ComponentLink1Description: http://www.seielect.com/Catalog/SEI-rncs.pdf
U7 = LTC2195: 16 bit, low power, dual ADC; Supplier 1: Digi-Key; Supplier Part Number 1: LTC2195CUKG#PBF-ND
U8 = AD8251: Programmable Gain Instumentation Amp; Supplier 1: Digi-Key; Supplier Part Number 1: AD8251ARMZ-ND
U9 U11 = AD8139: Differential ADC Driver; Supplier 1: Digi-Key; Supplier Part Number 1: LTC6406CMS8E#PBF-ND
U10 = AD8251: IC AMP INST ICMOS LDRIFT 10MSOP; Supplier 1: Digi-Key; Supplier Part Number 1: AD8251ARMZ-ND
U19 = ADR12x: Voltage Reference; Manufacturer: Analog Devices Inc; Manufacturer Part Number: ADR127AUJZ-REEL7; Reference Type: Series, Precision; Voltage - Output: 1.25V; Tolerance: ±0.24%; Temperature Coefficient: 25ppm/°C; Voltage - Input: 2.7 V ~ 18 V; Number of Channels: 1; Current - Quiescent: 95µA; Current - Output: 5mA; Supplier 1: Digi-Key; Supplier Part Number 1: ADR127AUJZ-REEL7CT-ND; RoHS: RoHS Compliant; Category: Integrated Circuits (ICs); Stock 1: 17098; Pricing 1: 1=3.22, 25=2.484, 100=2.254, 250=2.024, 500=1.748 (USD); Current - Cathode: -; Operating Temperature: -40°C ~ 125°C; Mounting Type: Surface Mount; Package / Case: TSOT-23-6, TSOT-6; Supplier Device Package: TSOT-6; Packaging: Cut Tape (CT); ComponentLink1URL: http://www.analog.com/static/imported-files/Data_Sheets/ADR121_125_127.pdf; ComponentLink1Description: http://www.analog.com/static/imported-files/Data_Sheets/ADR121_125_127.pdf

## Sheet KX1_DB_DAC_1.SchDoc
size 260 x 195 mm; PageSetup: Record=PageOptions|CenterHorizontal=True|CenterVertical=True|PrintScale=1.02|XCorrection=1.00|YCorrection=1.00|PrintKind=2|BorderSize=5000000|LeftOffset=0|BottomOffset=0|Orientation=2|PaperLength=1000|PaperWidth=1000|Scale=100|PaperSource=15|PrintQuality=600|MediaType=1|DitherType=10|PaperKind=Letter|PrintScaleMode=1
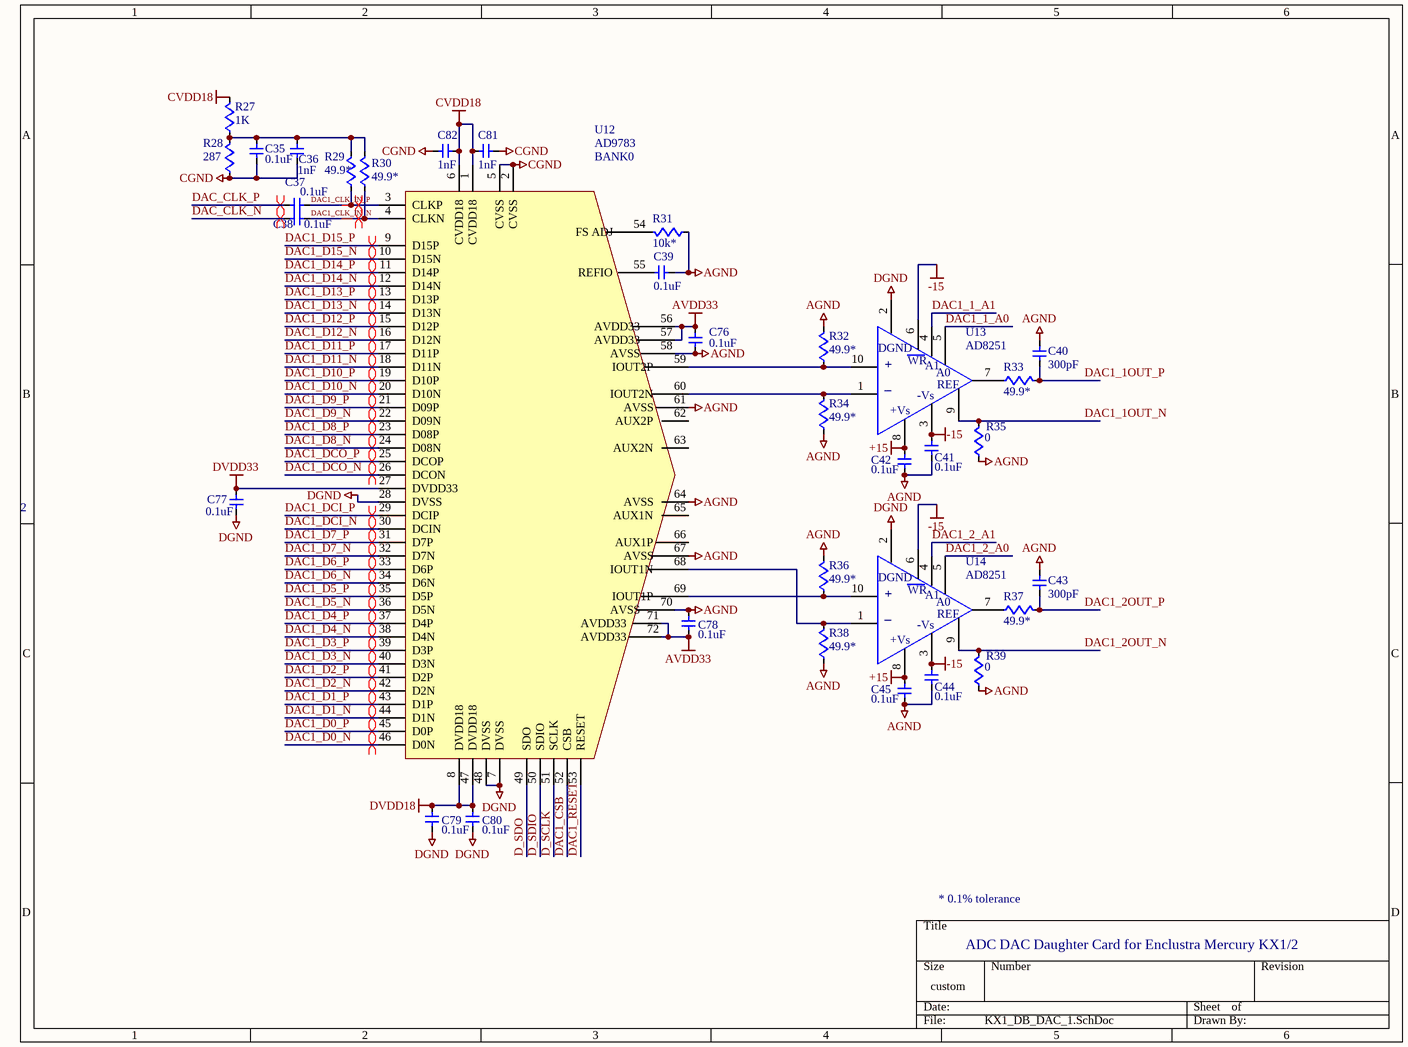
[diagram p2: KX1_DB_DAC_1.SchDoc]

### Parts
C35  0.1uF  [0603w]
C36  1nF  [0603w]
C37  0.1uF  [1206]
C38  0.1uF  [1206]
C39  0.1uF  [0603w]
C40  300pF  [0603w]
C41  0.1uF  [0603w]
C42  0.1uF  [0603w]
C43  300pF  [0603w]
C44  0.1uF  [0603w]
C45  0.1uF  [0603w]
C76  0.1uF  [0603w]
C77  0.1uF  [0603w]
C78  0.1uF  [0603w]
C79  0.1uF  [0603w]
C80  0.1uF  [0603w]
C81  1nF  [0603w]
C82  1nF  [0603w]
R27  1K  [0603w]
R28  287  [0603w]
R29  49.9*  [0603w]
R30  49.9*  [0603w]
R31  10k*  [0603w]
R32  49.9*  [0603w]
R33  49.9*  [0603w]
R34  49.9*  [0603w]
R35  0  [0603w]
R36  49.9*  [0603w]
R37  49.9*  [0603w]
R38  49.9*  [0603w]
R39  0  [0603w]
U12  AD9783  [LFCSP72]
U13  AD8251  [MSOP10sm]
U14  AD8251  [MSOP10sm]

### Nets
+15: C42.2 C45.2 U13.8 U14.8
-15: C41.2 C44.2 U13.3 U13.6 U14.3 U14.6
AGND: C35.2 C36.2 C39.2 C40.2 C41.1 C42.1 C43.2 C44.1 C45.1 C76.1 C77.2 C78.2 C79.1 C80.1 C81.2 C82.2 R28.1 R31.1 R32.2 R34.1 R35.1 R36.2 R38.1 R39.1 U12.2(CVSS) U12.5(CVSS) U12.7(DVSS) U12.28(DVSS) U12.48(DVSS) U12.58(AVSS) U12.61(AVSS) U12.64(AVSS) U12.67(AVSS) U12.70(AVSS) U13.2 U14.2  [also labelled CGND, DGND]
AVDD33: C76.2 C78.1 U12.56(AVDD33) U12.57(AVDD33) U12.71(AVDD33) U12.72(AVDD33)
CVDD18: C81.1 C82.1 R27.2 U12.1(CVDD18) U12.6(CVDD18)
DVDD18: C79.2 C80.2 U12.8(DVDD18) U12.47(DVDD18)
DVDD33: C77.1 U12.27(DVDD33)
D_SCLK: U12.51(SCLK)
D_SDIO: U12.50(SDIO)
D_SDO: U12.49(SDO)
DAC1_1_A0: U13.5
DAC1_1_A1: U13.4
DAC1_1OUT_N: R35.2 U13.9
DAC1_1OUT_P: C40.1 R33.2
DAC1_2_A0: U14.5
DAC1_2_A1: U14.4
DAC1_2OUT_N: R39.2 U14.9
DAC1_2OUT_P: C43.1 R37.2
DAC1_CLK_IN_N: C38.2 R30.1 U12.4(CLKN)
DAC1_CLK_IN_P: C37.2 R29.1 U12.3(CLKP)
DAC1_CSB: U12.52(CSB)
DAC1_D0_N: U12.46(D0N)
DAC1_D0_P: U12.45(D0P)
DAC1_D1_N: U12.44(D1N)
DAC1_D1_P: U12.43(D1P)
DAC1_D2_N: U12.42(D2N)
DAC1_D2_P: U12.41(D2P)
DAC1_D3_N: U12.40(D3N)
DAC1_D3_P: U12.39(D3P)
DAC1_D4_N: U12.38(D4N)
DAC1_D4_P: U12.37(D4P)
DAC1_D5_N: U12.36(D5N)
DAC1_D5_P: U12.35(D5P)
DAC1_D6_N: U12.34(D6N)
DAC1_D6_P: U12.33(D6P)
DAC1_D7_N: U12.32(D7N)
DAC1_D7_P: U12.31(D7P)
DAC1_D8_N: U12.24(D08N)
DAC1_D8_P: U12.23(D08P)
DAC1_D9_N: U12.22(D09N)
DAC1_D9_P: U12.21(D09P)
DAC1_D10_N: U12.20(D10N)
DAC1_D10_P: U12.19(D10P)
DAC1_D11_N: U12.18(D11N)
DAC1_D11_P: U12.17(D11P)
DAC1_D12_N: U12.16(D12N)
DAC1_D12_P: U12.15(D12P)
DAC1_D13_N: U12.14(D13N)
DAC1_D13_P: U12.13(D13P)
DAC1_D14_N: U12.12(D14N)
DAC1_D14_P: U12.11(D14P)
DAC1_D15_N: U12.10(D15N)
DAC1_D15_P: U12.9(D15P)
DAC1_DCI_N: U12.30(DCIN)
DAC1_DCI_P: U12.29(DCIP)
DAC1_DCO_N: U12.26(DCON)
DAC1_DCO_P: U12.25(DCOP)
DAC1_RESET: U12.53(RESET)
DAC_CLK_N: C38.1
DAC_CLK_P: C37.1
NetC35_1: C35.1 C36.1 R27.1 R28.2 R29.2 R30.2
NetC39_1: C39.1 U12.55(REFIO)
NetR31_2: R31.2 U12.54(FS_ADJ)
NetR32_1: R32.1 U12.59(IOUT2P) U13.10
NetR33_1: R33.1 U13.7
NetR34_2: R34.2 U12.60(IOUT2N) U13.1
NetR36_1: R36.1 U12.69(IOUT1P) U14.10
NetR37_1: R37.1 U14.7
NetR38_2: R38.2 U12.68(IOUT1N) U14.1

Not connected (* = marked no-connect by the designer): U12 62(AUX2P) 63(AUX2N) 65(AUX1N) 66(AUX1P)

### Layout directives
differential pair: DAC1_CLK_IN_N, DAC1_CLK_IN_P, DAC1_D0_N, DAC1_D0_P, DAC1_D1_N, DAC1_D1_P, DAC1_D2_N, DAC1_D2_P, DAC1_D3_N, DAC1_D3_P, DAC1_D4_N, DAC1_D4_P, DAC1_D5_N, DAC1_D5_P, DAC1_D6_N, DAC1_D6_P, DAC1_D7_N, DAC1_D7_P, DAC1_D8_N, DAC1_D8_P, DAC1_D9_N, DAC1_D9_P, DAC1_D10_N, DAC1_D10_P, DAC1_D11_N, DAC1_D11_P, DAC1_D12_N, DAC1_D12_P, DAC1_D13_N, DAC1_D13_P, DAC1_D14_N, DAC1_D14_P, DAC1_D15_N, DAC1_D15_P, DAC1_DCI_N, DAC1_DCI_P, DAC1_DCO_N, DAC1_DCO_P, DAC_CLK_N, DAC_CLK_P

### Notes on the sheet
- (near U12) BANK0
- 2
- * 0.1% tolerance
- ADC DAC Daughter Card for Enclustra Mercury KX1/2
- (in symbol AD8251) DGND; WR; +; A1; A0; _; REF; -Vs; +Vs

### Library data of the parts
C35 C39 C41 C42 C44 C45 C76-C80 = CAP_SM_1: as C14 on sheet KX1_DB_ADC_2; Applications: General Purpose; Category: Capacitors; ComponentLink1Description: http://www.kemet.com/datasheets&C0603C104K3RACTU; ComponentLink1URL: http://www.kemet.com/datasheets&C0603C104K3RACTU; Features: -; Lead Spacing: -; Lead Style: -; Mounting Type: Surface Mount, MLCC; Operating Temperature: -55°C ~ 125°C; Package / Case: 0603 (1608 Metric); Packaging: Cut Tape (CT); Pricing 1: 10=0.075, 100=0.027, 250=0.01952, 500=0.0144, 1000=0.00975 (USD); Ratings: -; RoHS: RoHS Compliant; Size / Dimension: 0.063" L x 0.032" W (1.60mm x 0.80mm); Stock 1: 2338960; Supplier 1: Digi-Key; Supplier Part Number 1: 399-1281-1-ND; Thickness: 0.80mm
C36 C81 C82 = CAP_SM_1: capacitor; Manufacturer: Murata Electronics North America; Manufacturer Part Number: GRM188R71H102KA01D; Capacitance: 1000pF; Voltage - Rated: 50V; Tolerance: ±10%; Temperature Coefficient: X7R; Supplier 1: Digi-Key; Supplier Part Number 1: 490-1494-1-ND; RoHS: RoHS Compliant; Category: Capacitors; Stock 1: 512721; Pricing 1: 1=0.07, 10=0.043, 50=0.0204, 100=0.0153, 250=0.01104, 500=0.00816, 1000=0.00553 (USD); Mounting Type: Surface Mount, MLCC; Operating Temperature: -55°C ~ 125°C; Applications: General Purpose; Ratings: -; Package / Case: 0603 (1608 Metric); Size / Dimension: 0.063" L x 0.031" W (1.60mm x 0.80mm); Height: -; Thickness: 0.035" (0.90mm); Lead Spacing: -; Features: -; Packaging: Cut Tape (CT); Lead Style: -; ComponentLink1URL: http://search.murata.co.jp/Ceramy/image/img/PDF/ENG/GRM188R71H102KA01.pdf; ComponentLink1Description: http://search.murata.co.jp/Ceramy/image/img/PDF/ENG/GRM188R71H102KA01.pdf
C37 C38 = CAP_SM_1: as C24 on sheet KX1_DB_ADC_2; Supplier 1: Digi-Key; Supplier Part Number 1: 490-1767-1-ND; RoHS: RoHS Compliant; Category: Capacitors; Stock 1: 374793; Pricing 1: 1=0.57, 10=0.48, 50=0.3436, 100=0.3007, 250=0.23628, 500=0.2148, 1000=0.17184 (USD); Mounting Type: Surface Mount, MLCC; Operating Temperature: -55°C ~ 125°C; Applications: General Purpose; Ratings: -; Package / Case: 1206 (3216 Metric); Size / Dimension: 0.126" L x 0.063" W (3.20mm x 1.60mm); Height: -; Thickness: 0.071" (1.80mm); Lead Spacing: -; Features: -; Packaging: Cut Tape (CT); Lead Style: -; ComponentLink1URL: http://search.murata.co.jp/Ceramy/image/img/PDF/ENG/GRM31C5C1E104JA01.pdf; ComponentLink1Description: http://search.murata.co.jp/Ceramy/image/img/PDF/ENG/GRM31C5C1E104JA01.pdf
C40 C43 = CAP_SM_1: capacitor; Supplier 1: Digi-Key; Supplier Part Number 1: 490-1438-1-ND
R27 = RES_SM: resistor; Manufacturer: Yageo; Manufacturer Part Number: RC0603FR-071KL; Power (Watts): 0.1W, 1/10W; Temperature Coefficient: ±100ppm/°C; Tolerance: ±1%; Supplier 1: Digi-Key; Supplier Part Number 1: 311-1.00KHRCT-ND; RoHS: RoHS Compliant; Category: Resistors; Stock 1: 4416298; Pricing 1: 10=0.014, 50=0.0104, 100=0.0079, 250=0.00584, 500=0.00432, 1000=0.00288 (USD); Resistance (Ohms): 1K; Composition: Thick Film; Features: -; Size / Dimension: 0.063" L x 0.031" W (1.60mm x 0.80mm); Height: 0.018" (0.45mm); Number of Terminations: 2; Packaging: Cut Tape (CT); Package / Case: 0603 (1608 Metric); ComponentLink1URL: http://www.yageo.com/documents/recent/PYu-RC0603_51_RoHS_L_4.pdf; ComponentLink1Description: http://www.yageo.com/documents/recent/PYu-RC0603_51_RoHS_L_4.pdf
R28 = RES_SM: resistor; Manufacturer: Yageo; Manufacturer Part Number: RC0603FR-07287RL; Power (Watts): 0.1W, 1/10W; Temperature Coefficient: ±100ppm/°C; Tolerance: ±1%; Supplier 1: Digi-Key; Supplier Part Number 1: 311-287HRCT-ND; RoHS: RoHS Compliant; Category: Resistors; Stock 1: 82528; Pricing 1: 10=0.014, 50=0.0104, 100=0.0079, 250=0.00584, 500=0.00432, 1000=0.00288 (USD); Resistance (Ohms): 287; Composition: Thick Film; Features: -; Size / Dimension: 0.063" L x 0.031" W (1.60mm x 0.80mm); Height: 0.018" (0.45mm); Number of Terminations: 2; Packaging: Cut Tape (CT); Package / Case: 0603 (1608 Metric); ComponentLink1URL: http://www.yageo.com/documents/recent/PYu-RC0603_51_RoHS_L_4.pdf; ComponentLink1Description: http://www.yageo.com/documents/recent/PYu-RC0603_51_RoHS_L_4.pdf
R29 R30 R32-R34 R36-R38 = RES_SM: as R47 on sheet KX1_DB_ADC_2; Supplier 1: Digi-Key; Supplier Part Number 1: RNCS0603BKE49R9CT-ND; RoHS: RoHS Compliant; Category: Resistors; Stock 1: 13782; Pricing 1: 1=0.7, 10=0.475, 50=0.2876, 100=0.2375, 250=0.18752, 500=0.16 (USD); Composition: Thin Film; Features: Anti-Corrosive, Moisture Resistant; Size / Dimension: 0.061" L x 0.031" W (1.55mm x 0.80mm); Height: 0.018" (0.45mm); Number of Terminations: 2; Packaging: Cut Tape (CT); Package / Case: 0603 (1608 Metric); ComponentLink1URL: http://www.seielect.com/Catalog/SEI-rncs.pdf; ComponentLink1Description: http://www.seielect.com/Catalog/SEI-rncs.pdf
R31 = RES_SM: resistor; Manufacturer: Susumu; Manufacturer Part Number: RG1608P-103-B-T5; Resistance (Ohms): 10K; Power (Watts): 0.1W, 1/10W; Temperature Coefficient: ±25ppm/°C; Tolerance: ±0.1%; Supplier 1: Digi-Key; Supplier Part Number 1: RG16P10.0KBCT-ND; RoHS: RoHS Compliant; Category: Resistors; Stock 1: 368390; Pricing 1: 10=0.409, 50=0.2478, 200=0.2047, 1000=0.10342 (USD); Composition: Thin Film; Features: -; Size / Dimension: 0.063" L x 0.031" W (1.60mm x 0.80mm); Height: 0.016" (0.40mm); Number of Terminations: 2; Packaging: Cut Tape (CT); Package / Case: 0603 (1608 Metric); ComponentLink1URL: http://www.susumu-usa.com/pdf/RG_RM_RGH_DATASHEET.pdf; ComponentLink1Description: http://www.susumu-usa.com/pdf/RG_RM_RGH_DATASHEET.pdf
R35 R39 = RES_SM: resistor; Supplier 1: Digi-Key; Supplier Part Number 1: P0.0GCT-ND
U12 = AD9783: DAC LVDS DUAL16BIT 500MSPS; Supplier 1: Digi-Key; Supplier Part Number 1: AD9783BCPZ-ND
U13 U14 = AD8251: IC AMP INST ICMOS LDRIFT 10MSOP; Supplier 1: Digi-Key; Supplier Part Number 1: AD8251ARMZ-ND